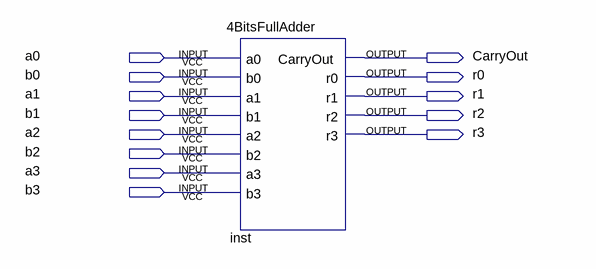
[diagram p0: schematic sheet]
// Quartus schematic Adder4Bits.bdf as structural Verilog: 1 symbols, 13 pins
module Adder4Bits (
  input  a0,
  input  b0,
  input  a1,
  input  b1,
  input  a2,
  input  b2,
  input  a3,
  input  b3,
  output CarryOut,
  output r0,
  output r1,
  output r2,
  output r3
);

  \4BitsFullAdder  inst (
    .a0(a0), .b0(b0), .a1(a1), .b1(b1), .a2(a2), .b2(b2), .a3(a3), .b3(b3), .CarryOut(CarryOut), .r0(r0),
    .r1(r1), .r2(r2), .r3(r3));
endmodule
